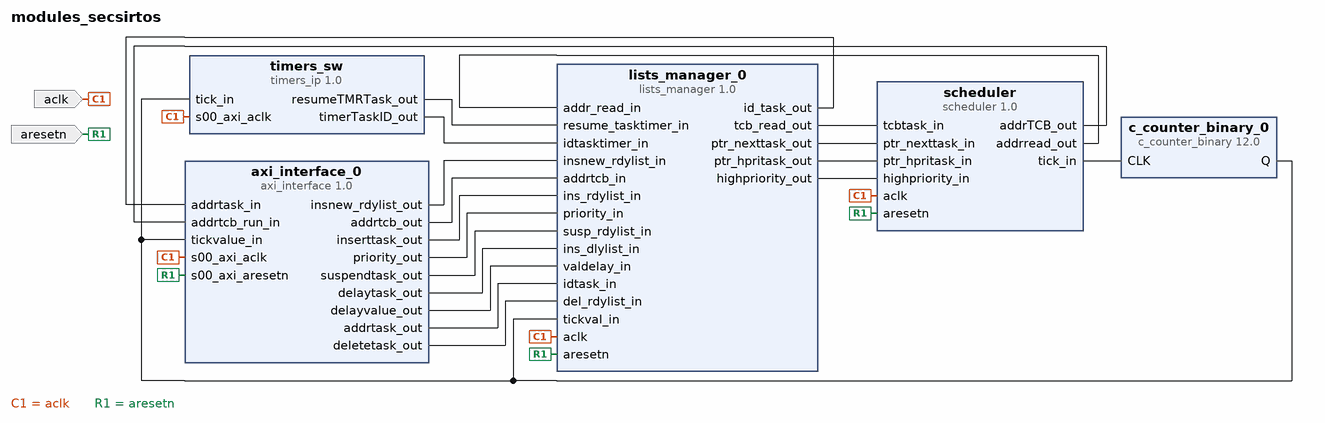
[diagram p0: block diagram of the top level]
# Vivado block design modules_secsirtos, xc7z020clg484-1, Vivado 2018.1
create_bd_design modules_secsirtos

create_bd_port -dir I aclk
create_bd_port -dir I aresetn

create_bd_cell -type ip -vlnv xilinx.com:user:axi_interface:1.0 axi_interface_0
create_bd_cell -type ip -vlnv xilinx.com:user:scheduler:1.0 scheduler
create_bd_cell -type ip -vlnv xilinx.com:user:timers_ip:1.0 timers_sw
create_bd_cell -type ip -vlnv xilinx.com:user:lists_manager:1.0 lists_manager_0
create_bd_cell -type ip -vlnv xilinx.com:ip:c_counter_binary:12.0 c_counter_binary_0
set_property -dict {CONFIG.Output_Width 32} [get_bd_cells c_counter_binary_0]

# ---- connections ----

connect_bd_net [get_bd_pins timers_sw/resumeTMRTask_out] [get_bd_pins lists_manager_0/resume_tasktimer_in]
connect_bd_net [get_bd_pins timers_sw/timerTaskID_out] [get_bd_pins lists_manager_0/idtasktimer_in]
connect_bd_net [get_bd_pins lists_manager_0/id_task_out] [get_bd_pins axi_interface_0/addrtask_in]
connect_bd_net [get_bd_pins lists_manager_0/tcb_read_out] [get_bd_pins scheduler/tcbtask_in]
connect_bd_net [get_bd_pins lists_manager_0/ptr_nexttask_out] [get_bd_pins scheduler/ptr_nexttask_in]
connect_bd_net [get_bd_pins lists_manager_0/ptr_hpritask_out] [get_bd_pins scheduler/ptr_hpritask_in]
connect_bd_net [get_bd_pins lists_manager_0/highpriority_out] [get_bd_pins scheduler/highpriority_in]
connect_bd_net [get_bd_pins scheduler/addrread_out] [get_bd_pins lists_manager_0/addr_read_in]
connect_bd_net [get_bd_pins scheduler/addrTCB_out] [get_bd_pins axi_interface_0/addrtcb_run_in]
connect_bd_net [get_bd_pins axi_interface_0/insnew_rdylist_out] [get_bd_pins lists_manager_0/insnew_rdylist_in]
connect_bd_net [get_bd_pins axi_interface_0/addrtcb_out] [get_bd_pins lists_manager_0/addrtcb_in]
connect_bd_net [get_bd_pins axi_interface_0/inserttask_out] [get_bd_pins lists_manager_0/ins_rdylist_in]
connect_bd_net [get_bd_pins axi_interface_0/priority_out] [get_bd_pins lists_manager_0/priority_in]
connect_bd_net [get_bd_pins axi_interface_0/suspendtask_out] [get_bd_pins lists_manager_0/susp_rdylist_in]
connect_bd_net [get_bd_pins axi_interface_0/delaytask_out] [get_bd_pins lists_manager_0/ins_dlylist_in]
connect_bd_net [get_bd_pins axi_interface_0/delayvalue_out] [get_bd_pins lists_manager_0/valdelay_in]
connect_bd_net [get_bd_pins axi_interface_0/addrtask_out] [get_bd_pins lists_manager_0/idtask_in]
connect_bd_net [get_bd_pins axi_interface_0/deletetask_out] [get_bd_pins lists_manager_0/del_rdylist_in]
connect_bd_net [get_bd_pins c_counter_binary_0/Q] \
  [get_bd_pins lists_manager_0/tickval_in] [get_bd_pins timers_sw/tick_in] [get_bd_pins axi_interface_0/tickvalue_in]
connect_bd_net [get_bd_pins scheduler/tick_in] [get_bd_pins c_counter_binary_0/CLK]
connect_bd_net [get_bd_ports aclk] \
  [get_bd_pins timers_sw/s00_axi_aclk] [get_bd_pins lists_manager_0/aclk] [get_bd_pins axi_interface_0/s00_axi_aclk] \
  [get_bd_pins scheduler/aclk]
connect_bd_net [get_bd_ports aresetn] \
  [get_bd_pins lists_manager_0/aresetn] [get_bd_pins scheduler/aresetn] [get_bd_pins axi_interface_0/s00_axi_aresetn]

validate_bd_design
save_bd_design
